# EasyEDA Pro project Source_r00fu_Synth .epro, board PCB1
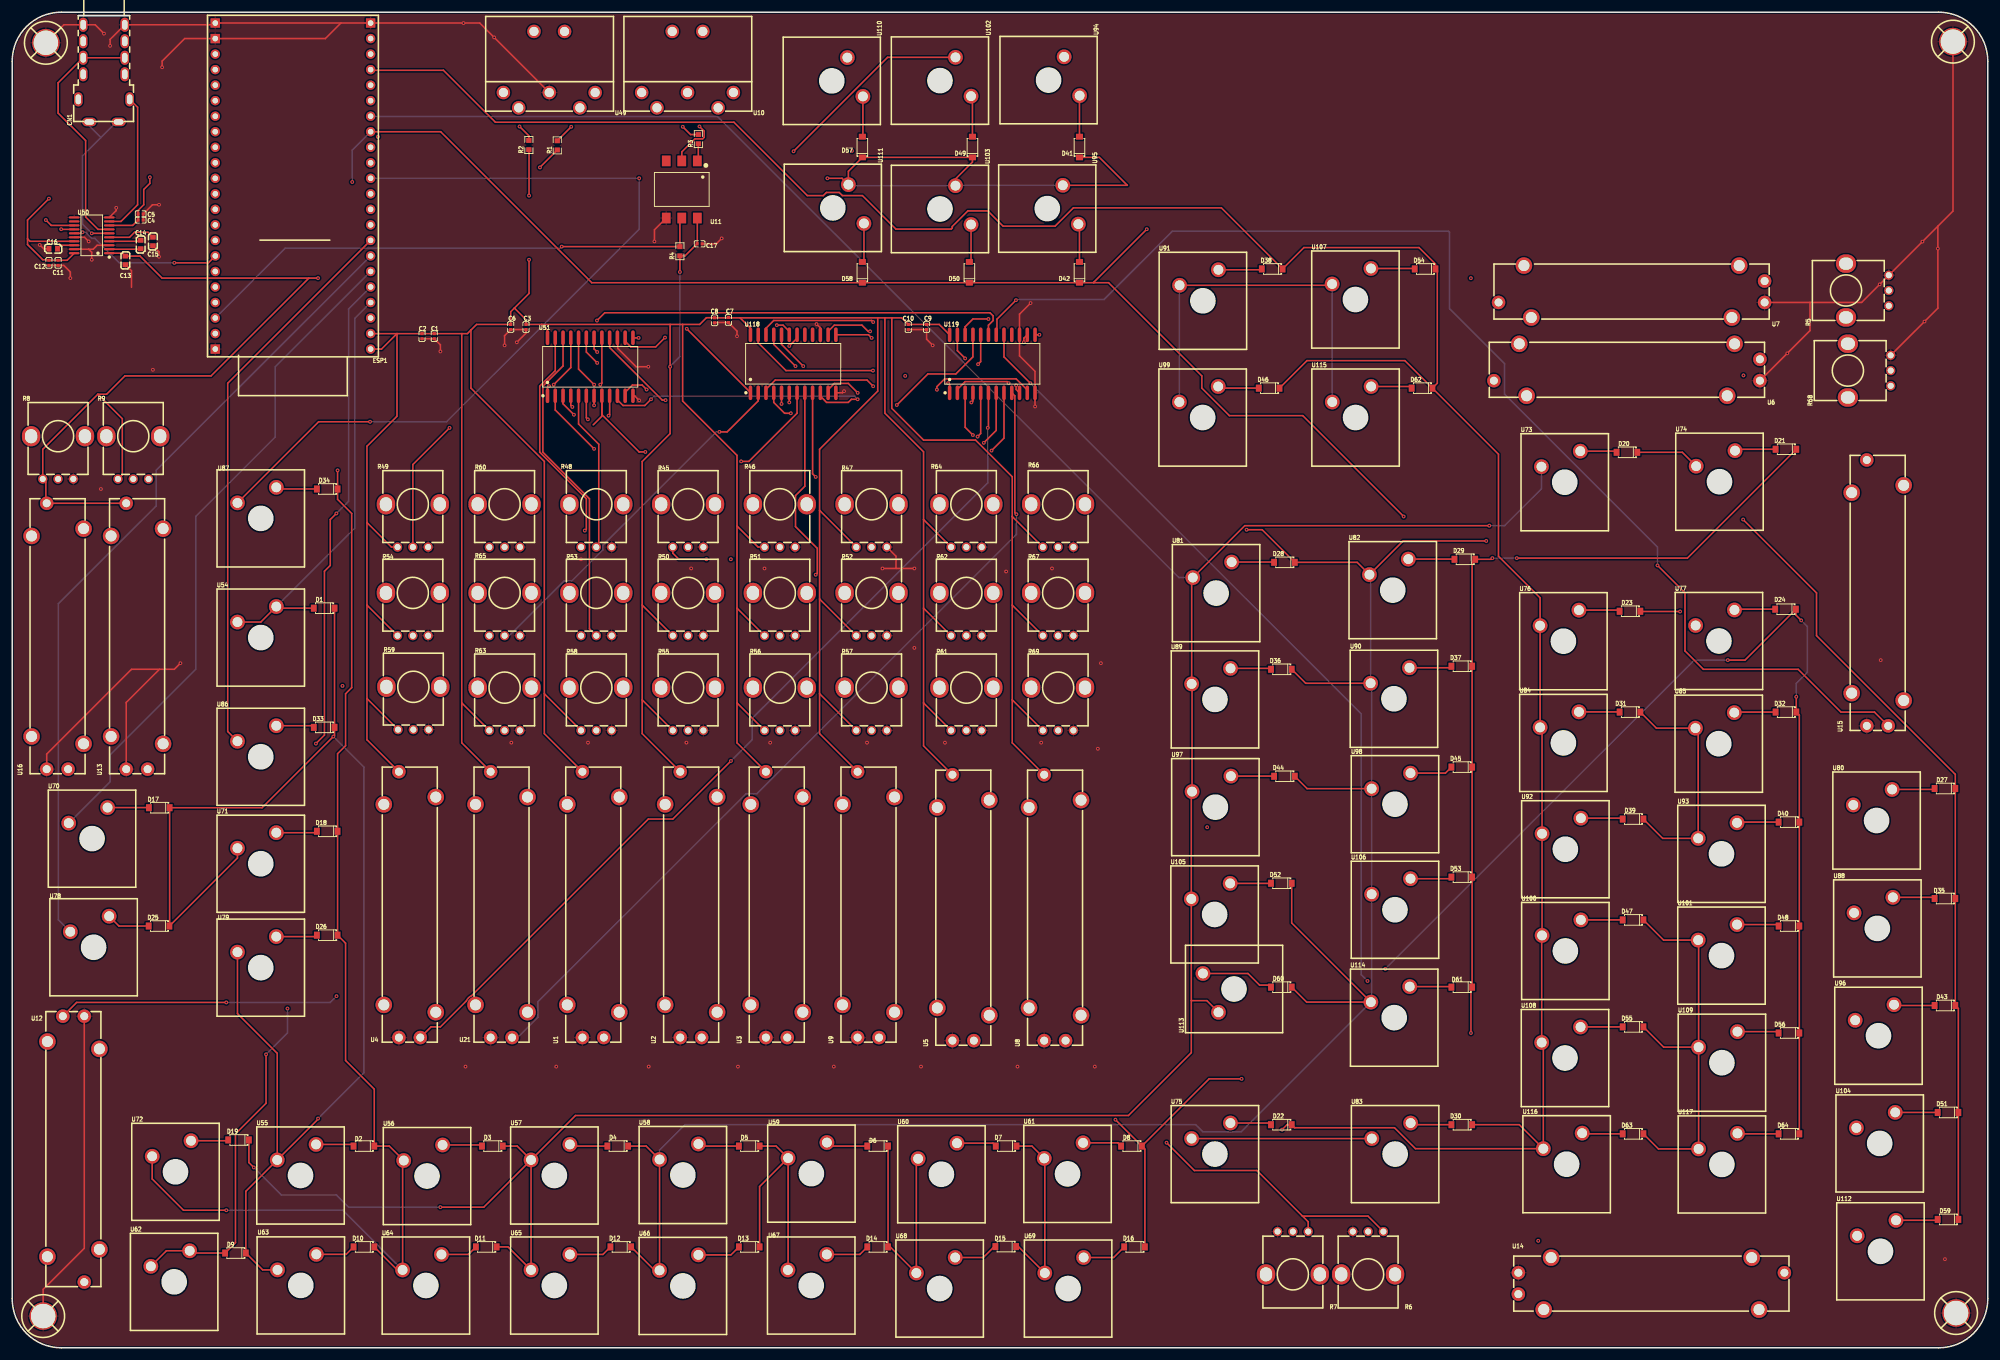
[diagram p1: board, top side]
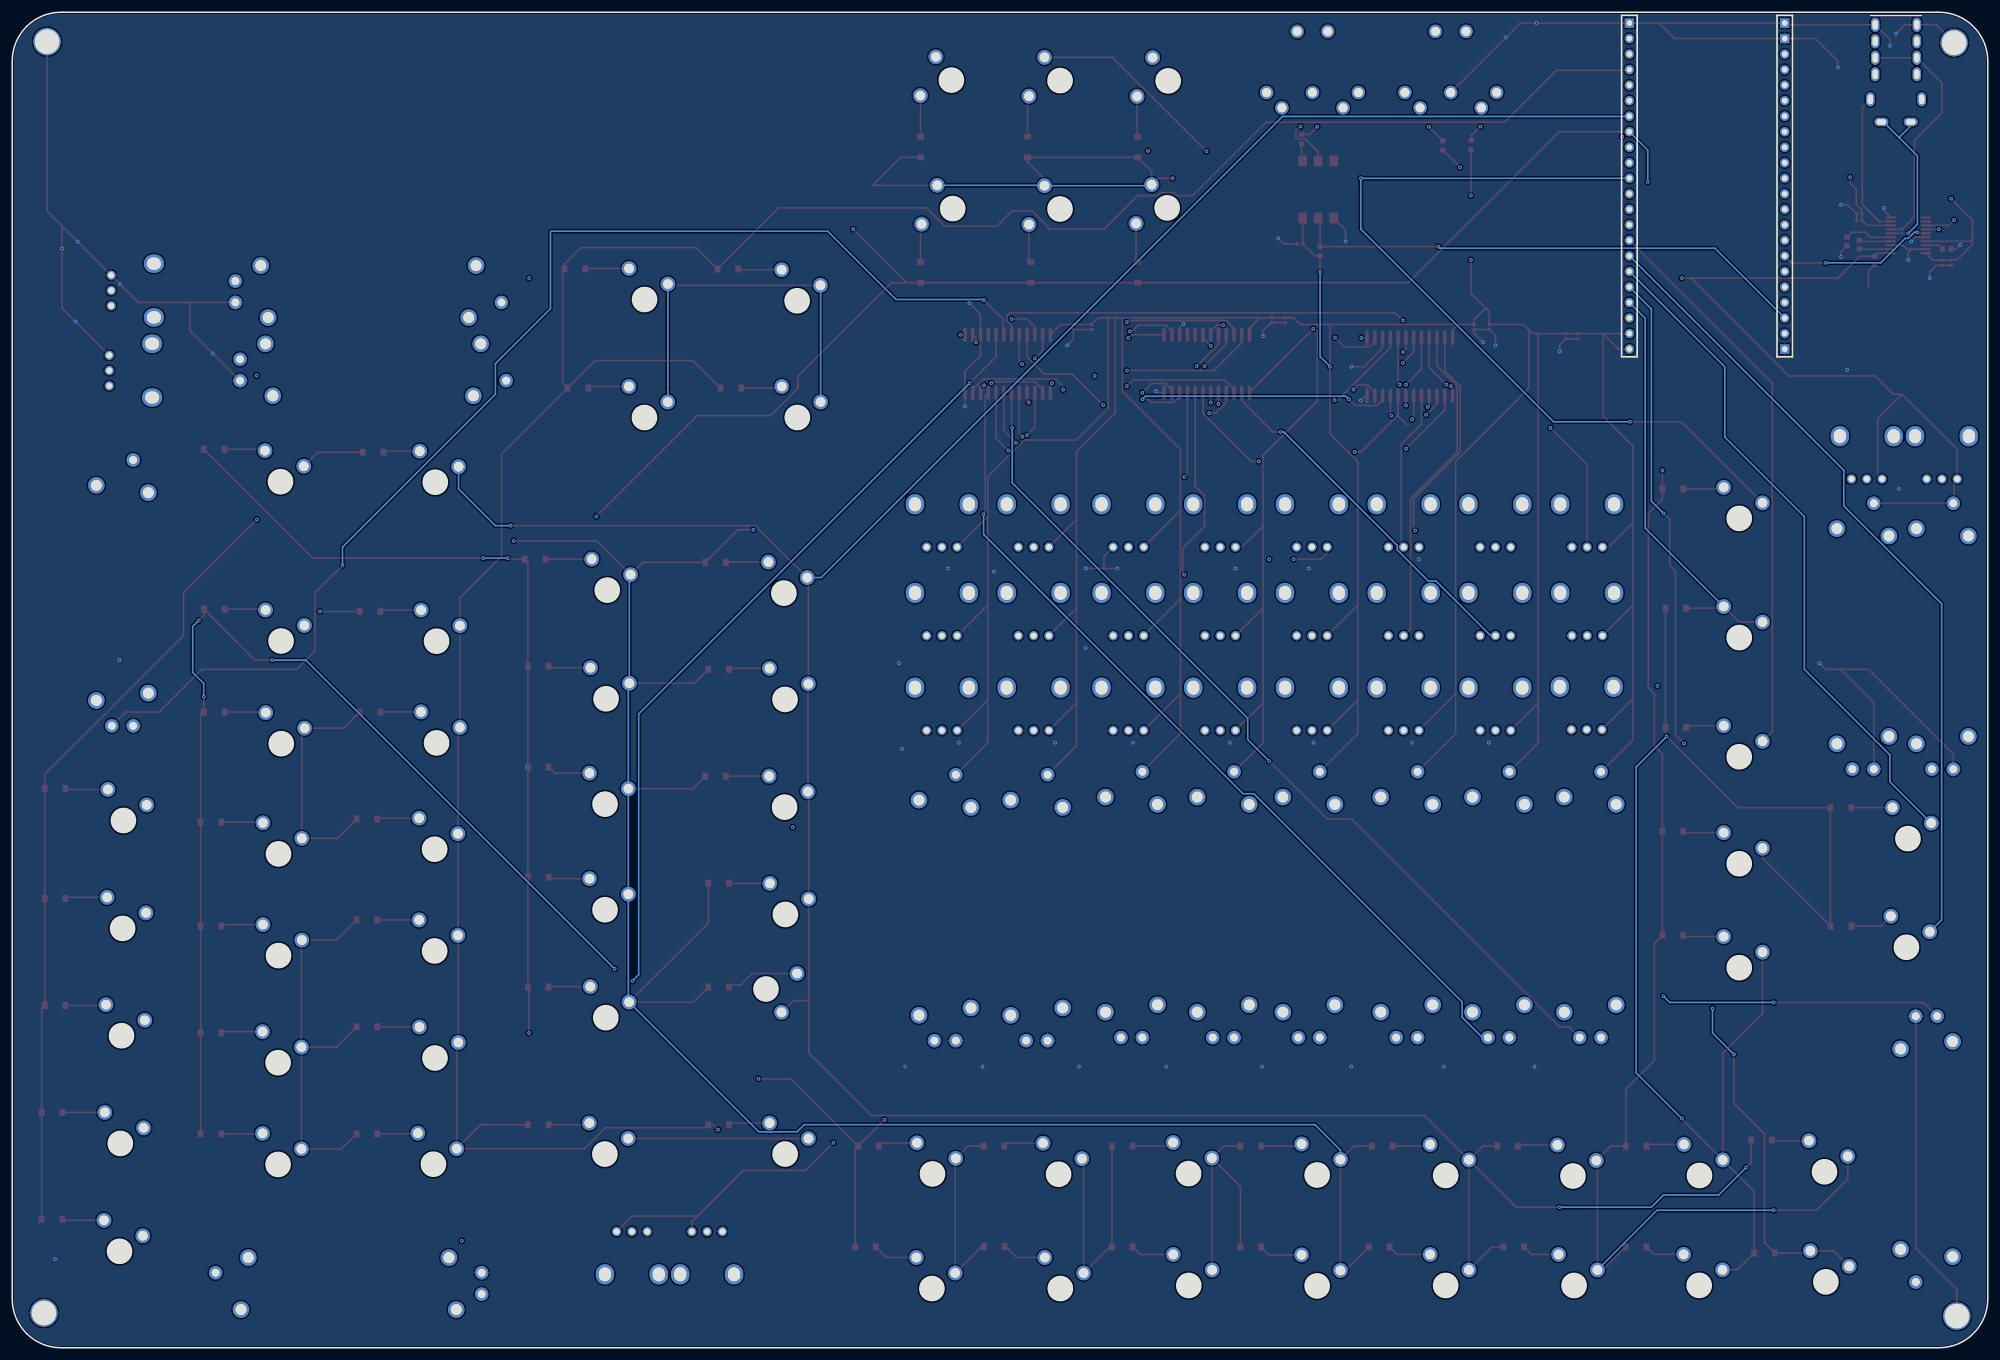
[diagram p2: board, bottom side, seen from below]

Outline 323 x 218.5 mm; copper layers: Top Layer, Inner1, Inner2, Inner3, Inner4, Inner5, Inner6, Bottom Layer. Coordinates in mm from the lower left corner of the outline.
Outline path: 0,210.5 0,8 arc(2.34,2.34) 8,0 315,0 arc(320.66,2.34) 323,8 323,210.5 arc(320.66,216.16) 315,218.5 8,218.5 arc(2.34,216.16) 0,210.5
Stack: Top Layer 0.035mm Outer layer thickness 1oz / Dielectric1 0.1164mm 2116 RC54% 4.9mil / Inner1 0.0152mm Inner layer thickness / Dielectric2 0.3mm 0.3mm H/HOZ No copper / Inner2 0.0152mm Inner layer thickness / Dielectric3 0.0764mm 1080 RC67% 3.3mil / Dielectric4 0.0764mm 1080 RC67% 3.3mil / Inner3 0.0152mm Inner layer thickness / Dielectric5 0.3mm 0.3mm H/HOZ No copper / Inner4 0.0152mm Inner layer thickness / Dielectric6 0.0764mm 1080 RC67% 3.3mil / Dielectric7 0.0764mm 1080 RC67% 3.3mil / Inner5 0.0152mm Inner layer thickness / Dielectric8 0.3mm 0.3mm H/HOZ No copper / Inner6 0.0152mm Inner layer thickness / Dielectric9 0.1164mm 2116 RC54% 4.9mil / Bottom Layer 0.035mm Outer layer thickness 1oz

## Design rules (mm)
spacing copperThickness1oz (default): track to track 0.102, other pairs 0.152 to 0.3
spacing copperThickness2oz: track to track 0.203, other pairs 0.152 to 0.3
track width copperThickness1oz (default): min 0.127, default 0.254, max 2.54
track width copperThickness2oz: min 0.203, default 0.254, max 2.54
differential pair differentialPair (default): width min 0.127, default 0.254, max 2.54; gap min 0.152, default 0.152
net GND uses copperRegion

## Placement (name value [footprint] x y rotation side)
C1  100nF  [C0402]  69 165.5 90 top
C2  10uF  [C0402]  67 165.5 90 top
C3  100nF  [C0402]  84 167 90 top
C4  100nF  [C0402]  21 184.5 180 top
C5  10uF  [C0402]  21 185.5 180 top
C6  10uF  [C0402]  81.5 167 90 top
C7  100nF  [C0402]  117.1 168.16 90 top
C8  10uF  [C0402]  114.84 168.1 90 top
C9  100nF  [C0402]  149.5 167 90 top
C10  10uF  [C0402]  146.5 167 90 top
C11  100nF  [C0402]  7.5 177.5 90 top
C12  10uF  [C0402]  6 177.5 90 top
C13  1uF  [C0603]  18.5 177.9 270 top
C14  1uF  [C0603]  21 180.5 90 top
C15  1uF  [C0603]  23 181 270 top
C16  1uF  [C0603]  6.7 179.8 0 top
C17  100nF  [C0402]  112.39 180.61 180 top
CN1  PJ-4506B-01-Z  [AUDIO-TH_PJ-4506B-01-Z]  15 208.5 90 top
D1  1N4148W  [SOD-123_L2.8-W1.8-LS3.7-RD-1]  51 121 180 top
D2  1N4148W  [SOD-123_L2.8-W1.8-LS3.7-RD-1]  57.5 33 180 top
D3  1N4148W  [SOD-123_L2.8-W1.8-LS3.7-RD-1]  78.5 33 180 top
D4  1N4148W  [SOD-123_L2.8-W1.8-LS3.7-RD-1]  99 33 180 top
D5  1N4148W  [SOD-123_L2.8-W1.8-LS3.7-RD-1]  120.5 33 180 top
D6  1N4148W  [SOD-123_L2.8-W1.8-LS3.7-RD-1]  141.5 33 180 top
D7  1N4148W  [SOD-123_L2.8-W1.8-LS3.7-RD-1]  162.5 33 180 top
D8  1N4148W  [SOD-123_L2.8-W1.8-LS3.7-RD-1]  183 33 180 top
D9  1N4148W  [SOD-123_L2.8-W1.8-LS3.7-RD-1]  36.5 15.5 180 top
D10  1N4148W  [SOD-123_L2.8-W1.8-LS3.7-RD-1]  57.5 16.5 180 top
D11  1N4148W  [SOD-123_L2.8-W1.8-LS3.7-RD-1]  77.5 16.5 180 top
D12  1N4148W  [SOD-123_L2.8-W1.8-LS3.7-RD-1]  99.5 16.5 180 top
D13  1N4148W  [SOD-123_L2.8-W1.8-LS3.7-RD-1]  120.5 16.5 180 top
D14  1N4148W  [SOD-123_L2.8-W1.8-LS3.7-RD-1]  141.5 16.5 180 top
D15  1N4148W  [SOD-123_L2.8-W1.8-LS3.7-RD-1]  162.44 16.55 180 top
D16  1N4148W  [SOD-123_L2.8-W1.8-LS3.7-RD-1]  183.5 16.5 180 top
D17  1N4148W  [SOD-123_L2.8-W1.8-LS3.7-RD-1]  24.04 88.35 180 top
D18  1N4148W  [SOD-123_L2.8-W1.8-LS3.7-RD-1]  51.5 84.5 180 top
D19  1N4148W  [SOD-123_L2.8-W1.8-LS3.7-RD-1]  37 34 180 top
D20  1N4148W  [SOD-123_L2.8-W1.8-LS3.7-RD-1]  264 146.5 180 top
D21  1N4148W  [SOD-123_L2.8-W1.8-LS3.7-RD-1]  290 147 180 top
D22  1N4148W  [SOD-123_L2.8-W1.8-LS3.7-RD-1]  207.5 36.5 180 top
D23  1N4148W  [SOD-123_L2.8-W1.8-LS3.7-RD-1]  264.5 120.5 180 top
D24  1N4148W  [SOD-123_L2.8-W1.8-LS3.7-RD-1]  289.94 120.83 180 top
D25  1N4148W  [SOD-123_L2.8-W1.8-LS3.7-RD-1]  24 69 180 top
D26  1N4148W  [SOD-123_L2.8-W1.8-LS3.7-RD-1]  51.5 67.5 180 top
D27  1N4148W  [SOD-123_L2.8-W1.8-LS3.7-RD-1]  316 91.5 180 top
D28  1N4148W  [SOD-123_L2.8-W1.8-LS3.7-RD-1]  208 128.5 180 top
D29  1N4148W  [SOD-123_L2.8-W1.8-LS3.7-RD-1]  237.5 129 180 top
D30  1N4148W  [SOD-123_L2.8-W1.8-LS3.7-RD-1]  237 36.5 180 top
D31  1N4148W  [SOD-123_L2.8-W1.8-LS3.7-RD-1]  264.5 104 180 top
D32  1N4148W  [SOD-123_L2.8-W1.8-LS3.7-RD-1]  290 104 180 top
D33  1N4148W  [SOD-123_L2.8-W1.8-LS3.7-RD-1]  51 101.5 180 top
D34  1N4148W  [SOD-123_L2.8-W1.8-LS3.7-RD-1]  51.5 140.5 180 top
D35  1N4148W  [SOD-123_L2.8-W1.8-LS3.7-RD-1]  316 73.5 180 top
D36  1N4148W  [SOD-123_L2.8-W1.8-LS3.7-RD-1]  207.5 111 180 top
D37  1N4148W  [SOD-123_L2.8-W1.8-LS3.7-RD-1]  237 111.5 180 top
D38  1N4148W  [SOD-123_L2.8-W1.8-LS3.7-RD-1]  206 176.5 180 top
D39  1N4148W  [SOD-123_L2.8-W1.8-LS3.7-RD-1]  265 86.5 180 top
D40  1N4148W  [SOD-123_L2.8-W1.8-LS3.7-RD-1]  290.5 86 180 top
D41  1N4148W  [SOD-123_L2.8-W1.8-LS3.7-RD-1]  174.49 196.44 90 top
D42  1N4148W  [SOD-123_L2.8-W1.8-LS3.7-RD-1]  174.49 175.94 90 top
D43  1N4148W  [SOD-123_L2.8-W1.8-LS3.7-RD-1]  316 56 180 top
D44  1N4148W  [SOD-123_L2.8-W1.8-LS3.7-RD-1]  208 93.5 180 top
D45  1N4148W  [SOD-123_L2.8-W1.8-LS3.7-RD-1]  237 95 180 top
D46  1N4148W  [SOD-123_L2.8-W1.8-LS3.7-RD-1]  205.5 157 180 top
D47  1N4148W  [SOD-123_L2.8-W1.8-LS3.7-RD-1]  265 70 180 top
D48  1N4148W  [SOD-123_L2.8-W1.8-LS3.7-RD-1]  290.5 69 180 top
D49  1N4148W  [SOD-123_L2.8-W1.8-LS3.7-RD-1]  156.99 196.44 90 top
D50  1N4148W  [SOD-123_L2.8-W1.8-LS3.7-RD-1]  156.49 175.94 90 top
D51  1N4148W  [SOD-123_L2.8-W1.8-LS3.7-RD-1]  316.5 38.5 180 top
D52  1N4148W  [SOD-123_L2.8-W1.8-LS3.7-RD-1]  207.5 76 180 top
D53  1N4148W  [SOD-123_L2.8-W1.8-LS3.7-RD-1]  237 77 180 top
D54  1N4148W  [SOD-123_L2.8-W1.8-LS3.7-RD-1]  231 176.5 180 top
D55  1N4148W  [SOD-123_L2.8-W1.8-LS3.7-RD-1]  265 52.5 180 top
D56  1N4148W  [SOD-123_L2.8-W1.8-LS3.7-RD-1]  290.5 51.5 180 top
D57  1N4148W  [SOD-123_L2.8-W1.8-LS3.7-RD-1]  138.99 196.44 90 top
D58  1N4148W  [SOD-123_L2.8-W1.8-LS3.7-RD-1]  138.99 175.94 90 top
D59  1N4148W  [SOD-123_L2.8-W1.8-LS3.7-RD-1]  316.5 21 180 top
D60  1N4148W  [SOD-123_L2.8-W1.8-LS3.7-RD-1]  207.5 59 180 top
D61  1N4148W  [SOD-123_L2.8-W1.8-LS3.7-RD-1]  237 59 180 top
D62  1N4148W  [SOD-123_L2.8-W1.8-LS3.7-RD-1]  230.5 157 180 top
D63  1N4148W  [SOD-123_L2.8-W1.8-LS3.7-RD-1]  265 35 180 top
D64  1N4148W  [SOD-123_L2.8-W1.8-LS3.7-RD-1]  290.5 35 180 top
ESP1  ESP32-S3-DEVKITC-MINI  [ESP32S3-DEVKIT-C1-V10]  58.6 163.39 180 top
R1  220Ω  [R0603]  89.11 196.72 90 top
R2  220Ω  [R0603]  84.47 196.77 90 top
R3  220Ω  [R0603]  112.18 197.74 90 top
R4  10kΩ  [R0603]  109.16 179.39 90 top
R5  10kΩ  [RES-ADJ-TH_RK09K1130A5R]  303.32 172.97 90 top
R6  10kΩ  [RES-ADJ-TH_RK09K1130A5R]  221.69 15.51 180 top
R7  10kΩ  [RES-ADJ-TH_RK09K1130A5R]  209.39 15.51 180 top
R8  10kΩ  [RES-ADJ-TH_RK09K1130A5R]  7.49 145.64 0 top
R9  10kΩ  [RES-ADJ-TH_RK09K1130A5R]  19.79 145.64 0 top
R45  10kΩ  [RES-ADJ-TH_RK09K1130A5R]  110.5 134.5 0 top
R46  10kΩ  [RES-ADJ-TH_RK09K1130A5R]  125.5 134.5 0 top
R47  10kΩ  [RES-ADJ-TH_RK09K1130A5R]  140.5 134.5 0 top
R48  10kΩ  [RES-ADJ-TH_RK09K1130A5R]  95.5 134.5 0 top
R49  10kΩ  [RES-ADJ-TH_RK09K1130A5R]  65.5 134.5 0 top
R50  10kΩ  [RES-ADJ-TH_RK09K1130A5R]  110.5 120 0 top
R51  10kΩ  [RES-ADJ-TH_RK09K1130A5R]  125.5 120 0 top
R52  10kΩ  [RES-ADJ-TH_RK09K1130A5R]  140.5 120 0 top
R53  10kΩ  [RES-ADJ-TH_RK09K1130A5R]  95.5 120 0 top
R54  10kΩ  [RES-ADJ-TH_RK09K1130A5R]  65.5 120 0 top
R55  10kΩ  [RES-ADJ-TH_RK09K1130A5R]  110.5 104.5 0 top
R56  10kΩ  [RES-ADJ-TH_RK09K1130A5R]  125.5 104.5 0 top
R57  10kΩ  [RES-ADJ-TH_RK09K1130A5R]  140.5 104.5 0 top
R58  10kΩ  [RES-ADJ-TH_RK09K1130A5R]  95.5 104.5 0 top
R59  10kΩ  [RES-ADJ-TH_RK09K1130A5R]  65.58 104.63 0 top
R60  10kΩ  [RES-ADJ-TH_RK09K1130A5R]  80.5 134.5 0 top
R61  10kΩ  [RES-ADJ-TH_RK09K1130A5R]  156 104.5 0 top
R62  10kΩ  [RES-ADJ-TH_RK09K1130A5R]  156 120 0 top
R63  10kΩ  [RES-ADJ-TH_RK09K1130A5R]  80.5 104.5 0 top
R64  10kΩ  [RES-ADJ-TH_RK09K1130A5R]  156 134.5 0 top
R65  10kΩ  [RES-ADJ-TH_RK09K1130A5R]  80.5 120 0 top
R66  10kΩ  [RES-ADJ-TH_RK09K1130A5R]  171 134.5 0 top
R67  10kΩ  [RES-ADJ-TH_RK09K1130A5R]  171 120 0 top
R68  10kΩ  [RES-ADJ-TH_RK09K1130A5R]  303.63 159.87 90 top
R69  10kΩ  [RES-ADJ-TH_RK09K1130A5R]  171 104.5 0 top
SCREW1  -  [Screw-Hole-M4]  5.5 213.5 0 top
SCREW2  -  [Screw-Hole-M4]  317.31 213.69 0 top
SCREW3  -  [Screw-Hole-M4]  5.06 5.19 0 top
SCREW4  -  [Screw-Hole-M4]  317.81 5.69 0 top
U1  PTA3043-2010CIB103  [RES-ADJ-TH_PTA3043]  95 72.5 90 top
U2  PTA3043-2010CIB103  [RES-ADJ-TH_PTA3043]  111 72.5 90 top
U3  PTA3043-2010CIB103  [RES-ADJ-TH_PTA3043]  125 72.5 90 top
U4  PTA3043-2010CIB103  [RES-ADJ-TH_PTA3043]  65 72.5 90 top
U5  PTA3043-2010CIB103  [RES-ADJ-TH_PTA3043]  155.5 72 90 top
U6  PTA3043-2010CIB103  [RES-ADJ-TH_PTA3043]  264 160 180 top
U7  PTA3043-2010CIB103  [RES-ADJ-TH_PTA3043]  264.76 172.8 180 top
U8  PTA3043-2010CIB103  [RES-ADJ-TH_PTA3043]  170.5 72 90 top
U9  PTA3043-2010CIB103  [RES-ADJ-TH_PTA3043]  140 72.5 90 top
U10  DIN-504D-M5  [CONN-TH_DIN-504D-M5]  110.41 209.11 180 top
U11  H11L1SR2M  [SMD-6_L8.7-W6.5-P2.54-LS10.6-BL]  109.47 189.5 180 top
U12  PTA3043-2010CIB103  [RES-ADJ-TH_PTA3043]  10 32.5 270 top
U13  PTA3043-2010CIB103  [RES-ADJ-TH_PTA3043]  20.41 116.41 90 top
U14  PTA3043-2010CIB103  [RES-ADJ-TH_PTA3043]  268 10.5 0 top
U15  PTA3043-2010CIB103  [RES-ADJ-TH_PTA3043]  305 123.5 90 top
U16  PTA3043-2010CIB103  [RES-ADJ-TH_PTA3043]  7.41 116.41 90 top
U21  PTA3043-2010CIB103  [RES-ADJ-TH_PTA3043]  80 72.5 90 top
U49  DIN-504D-M5  [CONN-TH_DIN-504D-M5]  87.81 209.11 180 top
U50  PCM5102APW  [TSSOP-20_L6.5-W4.4-P0.65-LS6.4-BL]  13 182 90 top
U51  CD74HC4067M  [SOIC-24_L15.4-W7.5-P1.27-LS10.3-BL]  94.5 160.5 0 top
U54  CPG151101D01  [SW-TH_CPG151101D9X]  40 120 0 top
U55  CPG151101D01  [SW-TH_CPG151101D9X]  46.5 32 0 top
U56  CPG151101D01  [SW-TH_CPG151101D9X]  67.19 31.91 0 top
U57  CPG151101D01  [SW-TH_CPG151101D9X]  88 32 0 top
U58  CPG151101D01  [SW-TH_CPG151101D9X]  109.01 32.07 0 top
U59  CPG151101D01  [SW-TH_CPG151101D9X]  130.03 32.31 0 top
U60  CPG151101D01  [SW-TH_CPG151101D9X]  151.29 32.2 0 top
U61  CPG151101D01  [SW-TH_CPG151101D9X]  171.91 32.26 0 top
U62  CPG151101D01  [SW-TH_CPG151101D9X]  25.84 14.6 0 top
U63  CPG151101D01  [SW-TH_CPG151101D9X]  46.55 14.02 0 top
U64  CPG151101D01  [SW-TH_CPG151101D9X]  67 14 0 top
U65  CPG151101D01  [SW-TH_CPG151101D9X]  88 14 0 top
U66  CPG151101D01  [SW-TH_CPG151101D9X]  109.01 13.93 0 top
U67  CPG151101D01  [SW-TH_CPG151101D9X]  130 14 0 top
U68  CPG151101D01  [SW-TH_CPG151101D9X]  151 13.5 0 top
U69  CPG151101D01  [SW-TH_CPG151101D9X]  172 13.5 0 top
U70  CPG151101D01  [SW-TH_CPG151101D9X]  12.41 87.11 0 top
U71  CPG151101D01  [SW-TH_CPG151101D9X]  40 83 0 top
U72  CPG151101D01  [SW-TH_CPG151101D9X]  26.06 32.6 0 top
U73  CPG151101D01  [SW-TH_CPG151101D9X]  253.2 145.42 0 top
U74  CPG151101D01  [SW-TH_CPG151101D9X]  278.5 145.5 0 top
U75  CPG151101D01  [SW-TH_CPG151101D9X]  196 35.5 0 top
U76  CPG151101D01  [SW-TH_CPG151101D9X]  252.98 119.41 0 top
U77  CPG151101D01  [SW-TH_CPG151101D9X]  278.41 119.44 0 top
U78  CPG151101D01  [SW-TH_CPG151101D9X]  12.67 69.34 0 top
U79  CPG151101D01  [SW-TH_CPG151101D9X]  40 66 0 top
U80  CPG151101D01  [SW-TH_CPG151101D9X]  304.19 90.08 0 top
U81  CPG151101D01  [SW-TH_CPG151101D9X]  196.2 127.28 0 top
U82  CPG151101D01  [SW-TH_CPG151101D9X]  225.08 127.76 0 top
U83  CPG151101D01  [SW-TH_CPG151101D9X]  225.47 35.5 0 top
U84  CPG151101D01  [SW-TH_CPG151101D9X]  252.98 102.77 0 top
U85  CPG151101D01  [SW-TH_CPG151101D9X]  278.38 102.64 0 top
U86  CPG151101D01  [SW-TH_CPG151101D9X]  40 100.5 0 top
U87  CPG151101D01  [SW-TH_CPG151101D9X]  40 139.5 0 top
U88  CPG151101D01  [SW-TH_CPG151101D9X]  304.31 72.42 0 top
U89  CPG151101D01  [SW-TH_CPG151101D9X]  196.01 109.88 0 top
U90  CPG151101D01  [SW-TH_CPG151101D9X]  225.28 109.99 0 top
U91  CPG151101D01  [SW-TH_CPG151101D9X]  194.04 175.1 0 top
U92  CPG151101D01  [SW-TH_CPG151101D9X]  253.3 85.38 0 top
U93  CPG151101D01  [SW-TH_CPG151101D9X]  278.83 84.61 0 top
U94  CPG151101D01  [SW-TH_CPG151101D9X]  173.25 208.03 270 top
U95  CPG151101D01  [SW-TH_CPG151101D9X]  173.04 187.01 270 top
U96  CPG151101D01  [SW-TH_CPG151101D9X]  304.5 54.86 0 top
U97  CPG151101D01  [SW-TH_CPG151101D9X]  196.08 92.26 0 top
U98  CPG151101D01  [SW-TH_CPG151101D9X]  225.44 92.75 0 top
U99  CPG151101D01  [SW-TH_CPG151101D9X]  194 156 0 top
U100  CPG151101D01  [SW-TH_CPG151101D9X]  253.3 68.73 0 top
U101  CPG151101D01  [SW-TH_CPG151101D9X]  278.83 67.97 0 top
U102  CPG151101D01  [SW-TH_CPG151101D9X]  155.49 207.94 270 top
U103  CPG151101D01  [SW-TH_CPG151101D9X]  155.49 186.94 270 top
U104  CPG151101D01  [SW-TH_CPG151101D9X]  304.69 37.24 0 top
U105  CPG151101D01  [SW-TH_CPG151101D9X]  195.95 74.71 0 top
U106  CPG151101D01  [SW-TH_CPG151101D9X]  225.44 75.47 0 top
U107  CPG151101D01  [SW-TH_CPG151101D9X]  218.98 175.31 0 top
U108  CPG151101D01  [SW-TH_CPG151101D9X]  253.24 51.21 0 top
U109  CPG151101D01  [SW-TH_CPG151101D9X]  278.9 50.45 0 top
U110  CPG151101D01  [SW-TH_CPG151101D9X]  137.81 207.9 270 top
U111  CPG151101D01  [SW-TH_CPG151101D9X]  137.98 187.12 270 top
U112  CPG151101D01  [SW-TH_CPG151101D9X]  304.82 19.59 0 top
U113  CPG151101D01  [SW-TH_CPG151101D9X]  195.95 58.06 90 top
U114  CPG151101D01  [SW-TH_CPG151101D9X]  225.31 57.82 0 top
U115  CPG151101D01  [SW-TH_CPG151101D9X]  219 156 0 top
U116  CPG151101D01  [SW-TH_CPG151101D9X]  253.51 33.84 0 top
U117  CPG151101D01  [SW-TH_CPG151101D9X]  278.9 33.81 0 top
U118  CD74HC4067M  [SOIC-24_L15.4-W7.5-P1.27-LS10.3-BL]  127.68 160.99 0 top
U119  CD74HC4067M  [SOIC-24_L15.4-W7.5-P1.27-LS10.3-BL]  160.25 160.98 0 top

## Footprints (pads in the part's own frame, mm; a bottom-side part is the same pattern mirrored in y, then rotated)
AUDIO-TH_PJ-4506B-01-Z
  oval 2.3x1.4 hole 1.6x0.9: A(7.95,-3.4) B(5.25,-3.4) C(2.55,-3.4) D(-0.15,-3.4) E(7.95,3.4) F(5.25,3.4) G(2.55,3.4) H(-0.15,3.4) K(-4.25,-4.2) L(-4.25,4.2)
  oval 1.4x2.3 hole 0.9x1.6: I(-7.95,-2.4) J(-7.95,2.4)
C0402
  rect 0.5x0.54 smd: 1(-0.42,0) 2(0.42,0)
C0603
  rect 0.8x0.9 smd: 1(-0.7,0) 2(0.7,0)
CONN-TH_DIN-504D-M5
  round 2.2 hole 1.5: 1(7.5,3.75) 2(0,3.75) 3(-7.5,3.75) 4(5,6.25) 5(-5,6.25) 6(-2.5,-6.25) 7(2.5,-6.25)
ESP32S3-DEVKIT-C1-V10
  round 1.524 hole 0.914: 0(25.4,-33.02) 1(25.4,-7.62) 2(25.4,-10.16) 3(0,-30.48) 4(0,-7.62) 5(0,-10.16) 5V(0,-50.8) 6(0,-12.7) 7(0,-15.24) 8(0,-27.94) 9(0,-35.56) 10(0,-38.1) 11(0,-40.64) 12(0,-43.18) 13(0,-45.72) 14(0,-48.26) 15(0,-17.78) 16(0,-20.32) 17(0,-22.86) 18(0,-25.4) 19(25.4,-48.26) 20(25.4,-45.72) 21(25.4,-43.18) 35(25.4,-30.48) 36(25.4,-27.94) 37(25.4,-25.4) 38(25.4,-22.86) 39(25.4,-20.32) 40(25.4,-17.78) 41(25.4,-15.24) 42(25.4,-12.7) 45(25.4,-35.56) 46(0,-33.02) 47(25.4,-40.64) 48(25.4,-38.1) RST(0,-5.08) RX(25.4,-5.08) TX(25.4,-2.54) VDD_1(0,0) VDD_2(0,-2.54)
  rect 1.524x1.524 hole 0.914: G1(0,-53.34) G2(25.4,0) G3(25.4,-50.8) G4(25.4,-53.34)
R0603
  rect 0.806x0.864 smd: 1(-0.753,0) 2(0.753,0)
RES-ADJ-TH_PTA3043
  round 2.2 hole 1.3: 1(-21.75,1.778) 2(-21.75,-1.722) 3(21.75,1.778)
  round 2.7 hole 1.8: 4(16.4,4.25) 5(-16.4,4.25) 6(-17.6,-4.25) 7(17.6,-4.25)
RES-ADJ-TH_RK09K1130A5R
  round 1.5 hole 1: 1(-2.5,-3.5) 2(0,-3.5) 3(2.5,-3.5)
  oval 3x3.3 hole 2x2.3: 4(4.4,3.5) 5(-4.4,3.5)
Screw-Hole-M4
  round 4.5 hole 4: 1(0,0)
SMD-6_L8.7-W6.5-P2.54-LS10.6-BL
  rect 1.423x1.75 smd: 1(-2.54,-4.675) 2(0,-4.675) 3(2.54,-4.675) 4(2.54,4.675) 5(0,4.675) 6(-2.54,4.675)
SOD-123_L2.8-W1.8-LS3.7-RD-1
  rect 0.95x1.15 smd: 1(-1.692,0) 2(1.692,0)
SOIC-24_L15.4-W7.5-P1.27-LS10.3-BL
  oval 0.574x2.388 smd: 1(-6.985,-4.744) 2(-5.715,-4.744) 3(-4.445,-4.744) 4(-3.175,-4.744) 5(-1.905,-4.744) 6(-0.635,-4.744) 7(0.635,-4.744) 8(1.905,-4.744) 9(3.175,-4.744) 10(4.445,-4.744) 11(5.715,-4.744) 12(6.985,-4.744) 13(6.985,4.744) 14(5.715,4.744) 15(4.445,4.744) 16(3.175,4.744) 17(1.905,4.744) 18(0.635,4.744) 19(-0.635,4.744) 20(-1.905,4.744) 21(-3.175,4.744) 22(-4.445,4.744) 23(-5.715,4.744) 24(-6.985,4.744)
SW-TH_CPG151101D9X
  round 2.4 hole 1.6: 1(-3.175,-1.27) 2(3.175,1.27)
TSSOP-20_L6.5-W4.4-P0.65-LS6.4-BL
  oval 0.364x1.742 smd: 1(-2.925,-2.871) 2(-2.275,-2.871) 3(-1.625,-2.871) 4(-0.975,-2.871) 5(-0.325,-2.871) 6(0.325,-2.871) 7(0.975,-2.871) 8(1.625,-2.871) 9(2.275,-2.871) 10(2.925,-2.871) 11(2.925,2.871) 12(2.275,2.871) 13(1.625,2.871) 14(0.975,2.871) 15(0.325,2.871) 16(-0.325,2.871) 17(-0.975,2.871) 18(-1.625,2.871) 19(-2.275,2.871) 20(-2.925,2.871)

## Nets
As in the schematic.

Pads without a net: CN1 B D F H L; ESP1 0 19 20 39 45 46 47 48 RST; R5 4 5; R6 4 5; R7 4 5; R8 4 5; R9 3 4 5; R45 4 5; R46 4 5; R47 4 5; R48 4 5; R49 4 5; R50 4 5; R51 4 5; R52 4 5; R53 4 5; R54 4 5; R55 4 5; R56 4 5; R57 4 5; R58 4 5; R59 4 5; R60 4 5; R61 4 5; R62 4 5; R63 4 5; R64 4 5; R65 4 5; R66 4 5; R67 4 5; R68 4 5; R69 4 5; U1 4 5 6 7; U2 4 5 6 7; U3 4 5 6 7; U4 4 5 6 7; U5 4 5 6 7; U6 4 5 6 7; U7 4 5 6 7; U8 4 5 6 7; U9 4 5 6 7; U10 1 2 3 6 7; U11 3; U12 4 5 6 7; U13 4 5 6 7; U14 4 5 6 7; U15 4 5 6 7; U16 4 5 6 7; U21 4 5 6 7; U49 1 3 6 7; U50 12

## Via types
v1: diameter 0.61, hole 0.305, Top Layer to Bottom Layer, 185 vias

## Routing (per net, layer and track width the routed paths; a pad name or vN(x,y) marks a point on that pad's centre or on a via; arc(x,y) is an arc through that point)
+3.3V: length 1795.1
  Top Layer w0.254: 143.81,168.5 145.42,168.5 C10.2 C9.2 151.56,167.42 U119.24 ; 143.81,168.5 142.68,168.5 ; 143.81,168.5 143.81,153.69 149,148.5 157.5,148.5 163.5,142.5 163.5,136 ; 73.53,165.92 C1.2 C2.2 62.91,165.92 ; 73.53,165.92 73.5,165.9 73.5,105.5 ; 73.53,165.92 74.42,165.92 75,166.5 ; 210.96,21.54 203.5,29 193.28,29 v1(188.73,33.55) ; 210.96,21.54 221.66,21.54 R6.1 ; 210.96,21.54 211.89,20.61 R7.1 ; 2.5,181.42 2.5,184.5 v1(6,188) ; 2.5,181.42 2.5,180.5 5,178 5.92,178 C12.2 C11.2 8.97,177.92 U50.20 ; 2.5,181.42 2.89,181.03 U50.17 ; 58,135 58,147.5 62.91,152.41 62.91,165.92 ; 58,135 58,121.5 ; 58,135 62,131 R49.1 ; R52.1 132,122.5 ; 132,122.5 132,137 ; 132,122.5 132,107 ; 48.5,175 24.5,175 20.9,178.6 C13.1 18.02,179.07 15.87,179.07 ; 48.5,175 32.5,159 18.42,159 15.42,156 14,156 ; 48.5,175 v1(50,175) ; R59.1 58,106.21 ; 58,106.21 58,99.47 U4.3 ; 58,106.21 58,121.5 ; R57.1 132,107 ; 132,107 132,100.47 U9.3 ; 163.5,136 163.5,121.5 ; 163.5,136 R66.1 ; U11.6 112.01,180.65 C17.2 110,178.64 R4.1 v1(109.16,176) ; U5.3 149,98.47 149,105.5 ; 119,168.5 114.86,168.5 C8.2 113.5,168.52 112.4,167.42 109.61,167.42 ; 119,168.5 141.51,168.5 ; 119,168.5 120.7,166.8 U118.24 ; 87,107 87,100.47 U1.3 ; 87,107 87,145 75,157 75,166.5 ; 87,107 R58.1 ; 149,121 149,135.5 ; 149,121 149,105.5 ; 149,121 R62.1 ; 149,135.5 R64.1 ; 149,135.5 149,146.58 142.68,152.9 142.68,168.5 ; v1(84.5,178) 84.5,172.5 82.1,170.1 ; U13.3 U16.3 5.5,138.3 5.5,141.62 R8.1 4.99,146.99 14,156 ; 149,105.5 R61.1 ; 82.1,170.1 84,168.21 C3.2 86.58,167.42 ; 82.1,170.1 81.5,169.5 C6.2 75.92,167.42 75,166.5 ; U50.8 19.7,183.62 C4.2 C5.2 20.58,186.08 21.5,187 21.5,189.5 22.5,190.5 v1(22.5,191.5) ; R46.1 121.94,131 118.5,134.45 ; R69.1 163.5,106 ; 163.5,106 163.5,98.97 U8.3 ; 163.5,106 163.5,121.5 ; 14,156 18,152 18,142.85 R9.1 ; R47.1 132,137 ; 132,137 132,147 141.51,156.51 141.51,168.5 ; R54.1 58,121.5 ; 62.91,165.92 60.38,163.39 ESP1.VDD_1 ; 62.91,165.92 58.61,165.92 ESP1.VDD_2 ; 142.68,168.5 141.51,168.5 ; v1(113.5,129) 109,129 108,130 R45.1 ; v1(84.5,188.5) 84.5,195.98 R2.1 ; 118.5,134.45 118.5,121 ; 118.5,134.45 118.5,146 109.61,154.89 109.61,167.42 ; 163.5,121.5 R67.1 ; 109.61,167.42 107.56,167.42 ; 118.5,121 118.5,105.5 ; 118.5,121 R51.1 ; 86.58,167.42 107.56,167.42 ; 86.58,167.42 87.5,166.5 87.5,165.26 U51.24 ; 73.5,105.5 73.5,98.97 U21.3 ; 73.5,105.5 R63.1 ; 107.56,167.42 v1(107.56,160.5) 107.56,149.56 103,145 103,121.5 ; 103,121.5 103,106 ; 103,121.5 R50.1 ; 103,106 103,100.47 U2.3 ; 103,106 R55.1 ; 118.5,105.5 118.5,98.97 U3.3 ; 118.5,105.5 R56.1
  Inner3 w0.254: 309,159.24 309,151.03 U15.3 ; 309,159.24 R68.1 ; 309,159.24 309,172.65 ; v1(117.5,129) v1(113.5,129) ; v1(249.5,17.5) 247.99,19.01 R6.1 ; v1(238.49,174.99) 245.5,182 303.5,182 309,176.5 309,172.65 ; 309,172.65 R5.1
  Inner4 w0.254: U14.3 260.22,12.28 255,17.5 v1(249.5,17.5) ; ESP1.VDD_2 50,174.53 v1(50,175) ; U8.3 171,91.47 171,88.5 179.5,80 179.5,42.78 v1(188.73,33.55)
  Inner5 w0.254: R45.1 105,128 90,128 ; 90,128 80,128 78,130 R60.1 ; 90,128 R48.1 ; v1(6,188) 19,188 v1(22.5,191.5) 23,192 23,194 32,203 32.25,203 32.72,202.53 33.63,202.53 34.24,201.92 34.24,201.02 50,185.25 v1(50,175) ; 235,167.24 235,171.5 v1(238.49,174.99) ; 235,167.24 238.78,171.02 U7.3 ; 235,167.24 235,165.47 U6.3 213.53,129.5 200.5,129.5 arc(199.37,130.03) 198.24,129.5 170,129.5 R66.1 ; v1(117.5,129) 121,129 R46.1
  Inner6 w0.254: R65.1 79.5,115 ; 79.5,115 91.5,115 R53.1 ; 79.5,115 64.5,115 R54.1 ; U12.3 20.03,19 25,19 35,29 35,48 63.22,76.22 U4.3 ; v1(84.5,188.5) v1(84.5,178)
  Bottom Layer w0.254: 107.5,160.5 109.16,162.16 v1(109.16,176)
AGND: length 23.5
  Top Layer w0.254: U50.9 17.77,184.28 20.5,187 20.5,202.95 CN1.K
GND: length 1013.8
  Top Layer w0.254: 314.84,183.49 v1(314.84,179.83) 314.84,170.09 v1(312.65,167.89) R68.3 ; 314.84,183.49 v1(312.32,180.97) R5.3 v1(305.33,173.98) 302.37,171.02 293.94,171.02 ; 314.84,183.49 317.31,185.95 SCREW2.1 ; U118.12 135.74,156.24 v1(136,156.5) ; v1(27.5,112) 26.5,111 24.06,111 ; v1(16,213) 16,214.05 CN1.A 32.92,216.45 ESP1.G4 53.73,216.73 ; U12.1 11.78,16.28 5.06,9.56 SCREW3.1 ; 24.06,111 18.64,105.57 U13.1 ; 24.06,111 19.5,111 5.64,97.14 U16.1 ; v1(167.23,154) U119.12 167.23,159.74 164.69,162.28 U119.15 164.69,169.11 v1(166.5,170.92) ; v1(102.5,155) 101.74,155.76 U51.12 ; 53.73,216.73 ESP1.G1 v1(73.78,216.73) 76.44,216.73 v1(78.79,214.38) U49.2 ; 53.73,216.73 51.19,214.19 ESP1.G3 28.19,214.19 24.5,210.5 v1(24.5,209.5) ; 144.5,127.5 v1(147.5,127.5) ; 144.5,127.5 144.5,129.5 R47.3 ; 144.5,127.5 v1(142.28,127.5) ; SCREW1.1 8.45,216.45 CN1.E 13.55,216.45 v1(15,215) ; 5.51,177.09 5.5,177.08 ; U50.10 17,186.05 v1(17,186.5) ; v1(24,178.5) 24,179.3 C15.2 ; C2.1 C1.1 70,164.08 v1(70,163) ; U6.1 v1(290.22,162.69) 293.94,166.42 293.94,171.02 ; U118.15 132.13,166.86 v1(131.5,167.48) ; v1(4.5,180.44) 5.14,179.8 C16.1 ; C13.2 19.5,176.2 19.5,173.5 ; v1(82.5,164.5) 84,166 C3.1 C6.1 80.5,165.58 v1(80.5,164) ; C4.1 C5.1 22.92,187 v1(24,187) ; v1(9.5,175) 9.5,176 8.42,177.08 C11.1 C12.1 ; U50.16 11.82,181.68 v1(12.5,181) ; 12.5,179.72 13,179.22 v1(13,178) ; 12.5,179.72 U50.19 ; 12.5,179.72 13.22,179.72 13.88,180.38 U50.3 ; v1(116,181.5) 115.11,180.61 112.81,180.61 ; 293.94,171.02 286.51,171.02 ; v1(118.5,165.5) 118.5,166.33 C7.1 114.9,167.74 C8.1 ; U11.4 105,182.9 v1(105,181) ; v1(150.5,164) 149.5,165 C9.1 C10.1 ; U51.15 99,165.19 99,163.5 102,160.5 v1(104,160.5)
  Inner1 w0.254: v1(170,127.5) R66.3 ; R64.3 v1(162.5,127)
  Inner2 w0.254: 114.26,114.5 114.26,115.24 R50.3 ; 114.26,114.5 99.81,114.5 ; 114.26,114.5 129.52,114.5 ; 99.81,114.5 84.96,114.5 ; 99.81,114.5 99.81,114.69 R53.3 ; 85.5,129 70,129 R49.3 ; 85.5,129 83.5,131 R60.3 ; 85.5,129 v1(93,129) ; 129.52,114.5 144,114.5 ; 129.52,114.5 128,116.02 R51.3 ; 144,114.5 v1(147.5,114.5) ; 144,114.5 144,115.5 R52.3 ; 84.96,114.5 70,114.5 R54.3 ; 84.96,114.5 84.96,114.54 R65.3
  Inner3 w0.254: v1(147.5,127.5) 155,127.5 ; 155,127.5 v1(170,127.5) ; 155,127.5 R64.3
  Inner4 w0.254: R56.3 128.93,100.07 128.93,99 ; 145,99 R57.3 ; 145,99 v1(139.76,99) 128.93,99 ; 145,99 v1(152.5,99) ; 100,129 R48.3 ; 100,129 v1(93,129) ; 100,129 112,129 113.5,127.5 v1(123,127.5) ; U4.1 67.97,46 v1(74.11,46) 81.5,46 ; 142.97,46 v1(134.33,46) 127.31,46 ; 142.97,46 U9.1 ; 142.97,46 v1(148.58,46) 157.97,46 ; 171.01,46 168.72,48.29 U8.1 ; 171.01,46 v1(177,46) ; 171.01,46 v1(164.36,46) 157.97,46 ; 84.01,99 83,100.01 R63.3 ; 84.01,99 v1(94.14,99) 99,99 ; 84.01,99 v1(81.6,99) 70.21,99 R59.3 ; 113.5,99 v1(123.93,99) 128.93,99 ; 113.5,99 113,99.5 R55.3 ; 113.5,99 v1(110.23,99) 99,99 ; v1(316,14.5) 317.81,12.69 SCREW4.1 ; 81.5,46 v1(88.94,46) 96,46 ; 81.5,46 78.22,49.28 U21.1 ; 96,46 v1(104.07,46) 111.57,46 ; 96,46 93.22,48.78 U1.1 ; 157.97,46 U5.1 ; U3.1 123.22,50.09 127.31,46 ; 111.57,46 v1(118.65,46) 127.31,46 ; 111.57,46 109.22,48.35 U2.1 ; U15.1 303.22,110.22 v1(305.5,112.5) ; 99,99 98,100 R58.3
  Inner5 w0.254: v1(111,127.5) 112,128.5 112.5,128.5 112.92,128.92 112.92,129.24 113,129.33 R45.3 ; R46.3 129,130 129,127.5 ; 129,127.5 v1(142.28,127.5) ; 129,127.5 v1(123,127.5)
  Inner6 w0.254: 159.83,114.5 174.37,114.5 ; 159.83,114.5 159.83,115.17 R62.3 ; 159.83,114.5 v1(147.5,114.5) ; 174.37,114.5 174.37,115.63 R67.3 ; 174.37,114.5 175.5,114.5 v1(178,112) ; v1(23,160) 29.81,160 ESP1.G2 ; 174.65,99 v1(168.23,99) 159.5,99 ; 174.65,99 176.5,99 v1(177.5,98) ; 174.65,99 174.65,99.85 R69.3 ; v1(14.5,140.5) 11.62,140.5 R8.3 ; v1(152.5,99) 159.5,99 ; 159.5,99 159.5,100 R61.3
1S0: length 164
  Top Layer w0.254: v1(104.44,155.18) 103.43,154.16 99.87,154.16 98.94,155.08 U51.10 ; v1(138.22,155.18) 137.21,155.18 136.7,154.67 133.14,154.67 132.13,155.68 U118.10 ; U119.10 164.13,156.79 v1(164.13,157.46)
  Inner4 w0.254: ESP1.35 34.3,192.77 66.85,192.77 v1(104.44,155.18) ; v1(138.22,155.18) 138.99,155.94 162.61,155.94 v1(164.13,157.46)
  Bottom Layer w0.254: v1(138.22,155.18) 137.72,155.68 104.95,155.68 v1(104.44,155.18)
1S1: length 166.3
  Top Layer w0.254: U51.11 100.22,156.32 101.4,157.5 102.99,157.5 v1(103.72,156.77) ; U118.11 133.4,156.75 134.41,157.77 136.7,157.77 v1(138.23,156.23) ; U119.11 165.92,156.28 165.92,156.74 164.14,158.52 152.46,158.52 151.19,157.25 v1(151.19,156.74)
  Inner2 w0.254: v1(103.72,156.77) 104.73,155.76 137.75,155.76 v1(138.23,156.23)
  Inner3 w0.254: v1(138.23,156.23) 150.68,156.23 v1(151.19,156.74) ; v1(103.72,156.77) 83.14,177.35 58.25,177.35 50.63,184.97 32.85,184.97 32.09,185.73 32.09,190.22 ESP1.36
1S2: length 162.4
  Top Layer w0.254: U51.14 100.22,164.67 101.14,163.75 105.2,163.75 v1(106.73,165.27) ; U119.14 165.4,165.16 v1(165.4,164.51) ; U118.14 133.4,166.29 134.41,167.31 138.92,167.31 139.94,166.29 v1(140.26,166.29)
  Inner3 w0.254: ESP1.37 51.97,188.79 58.21,182.55 89.46,182.55 v1(106.73,165.27) 107.97,165.27 110.76,168.07 138.48,168.07 v1(140.26,166.29)
  Inner4 w0.254: v1(165.4,164.51) 163.62,166.29 v1(140.26,166.29)
1S3: length 152
  Top Layer w0.254: U119.13 167.24,165.73 v1(167.94,165.73) ; v1(102.41,165.22) 101.51,165.22 U51.13 ; U118.13 140,165.73 v1(140.51,165.22)
  Inner1 w0.254: v1(140.51,165.22) 139.8,164.51 104.42,164.51 103.71,165.22 v1(102.41,165.22)
  Inner3 w0.254: ESP1.38 51.92,186.25 58.21,179.95 87.68,179.95 v1(102.41,165.22)
  Inner5 w0.254: v1(140.51,165.22) 167.43,165.22 v1(167.94,165.73)
A0: length 52.1
  Top Layer w0.254: R49.2 65.5,144.5 v1(71.5,150.5) ; v1(97.5,152.5) 97.67,152.68 U51.9
  Inner2 w0.254: v1(97.5,152.5) 95.5,150.5 v1(71.5,150.5)
A1: length 61.5
  Top Layer w0.254: v1(103.52,146.56) 102.5,146.56 96.41,152.66 U51.8 96.41,152.41 95,151
  Inner2 w0.254: R47.2 140.43,131.07 139.58,131.07 124.09,146.56 v1(103.52,146.56)
A2: length 41.7
  Top Layer w0.254: U51.7 v1(95.14,154.18)
  Inner1 w0.254: v1(95.14,154.18) 95.14,153.93 116.98,132.08 123.58,132.08 124.6,131.07 125.43,131.07 R46.2
A3: length 31.8
  Top Layer w0.254: U51.6 93.86,152.15 v1(94.12,151.89)
  Inner3 w0.254: v1(94.12,151.89) 104.28,141.74 104.28,136.91 110.19,131 R45.2
A4: length 26.3
  Top Layer w0.254: U51.5 92.59,151.13 95.9,147.83 95.9,131.4 R48.2
A5: length 50.2
  Top Layer w0.254: U51.4 91.33,154.18 v1(91.58,153.93)
  Inner6 w0.254: v1(91.58,153.93) 78.12,140.47 78.12,137.16 65.5,124.55 R54.2
A6: length 68.9
  Top Layer w0.254: U51.3 90.06,154.44 v1(91.83,152.66)
  Inner2 w0.254: v1(91.83,152.66) 92.34,153.17 97.67,153.17 102.75,148.08 102.75,146.31 131.46,117.61 139.39,117.61 R52.2
A7: length 55.7
  Top Layer w0.254: U51.2 88.78,153.42 v1(95.14,147.07)
  Inner3 w0.254: v1(95.14,147.07) 95.14,145.55 109.36,131.32 109.36,130.56 114.44,125.48 115.71,125.48 124.6,116.59 125.41,116.59 R51.2
A8: length 60.6
  Top Layer w0.254: v1(93.61,133.7) 93.86,133.95 93.86,138.91 86.25,146.53 86.25,157.32 88.78,159.86 U51.23
  Inner3 w0.254: R50.2 110.14,116.86 109.94,116.86 96.91,129.89 96.91,131.16 94.37,133.7 v1(93.61,133.7)
A9: length 53.7
  Top Layer w0.254: R53.2 94.37,117.63 94.37,138.91 86.75,146.53 86.75,157.32 90.06,160.62 U51.22
A10: length 74.8
  Top Layer w0.254: U51.21 91.33,160.37 v1(88.53,157.57)
  Inner1 w0.254: R59.2 65.67,101.22 65.67,107.16 88.53,130.01 v1(88.53,157.57)
A11: length 87.2
  Top Layer w0.254: v1(95.14,157.57) 92.59,160.11 U51.20
  Inner1 w0.254: R57.2 140.5,107 126.89,120.62 126.89,131.16 125.87,132.17 124.09,132.17 116.22,140.05 112.66,140.05 v1(95.14,157.57)
A12: length 77.3
  Top Layer w0.254: v1(95.64,161.13) 93.86,162.91 U51.19
  Inner4 w0.254: v1(95.64,161.13) 95.64,160.62 124.34,131.92 124.34,102.16 R56.2
A13: length 70.6
  Top Layer w0.254: U51.18 95.14,163.41 v1(95.64,162.91)
  Inner6 w0.254: v1(95.64,162.91) 109.36,149.19 109.36,102.14 R55.2
A14: length 65
  Top Layer w0.254: v1(96.15,157.57) 96.41,157.83 U51.17
  Inner6 w0.254: v1(96.15,157.57) 96.15,131.92 96.66,131.41 96.66,102.16 R58.2
A15: length 73.4
  Top Layer w0.254: v1(106.82,155.03) 106.28,155.03 97.67,163.64 U51.16
  Inner6 w0.254: R64.2 154.83,132.17 129.68,132.17 v1(106.82,155.03)
B0: length 51.3
  Top Layer w0.254: v1(131.37,142.47) 130.86,142.98 U118.9
  Inner4 w0.254: R62.2 154.94,117.56 154.76,117.56 141.78,130.54 141.78,131.3 141.02,132.06 139.24,132.06 131.37,139.94 v1(131.37,142.47)
B1: length 68.7
  Top Layer w0.254: U118.8 129.59,140.95 128.06,139.43 128.06,134.35 131.62,130.79 131.62,126.73 v1(131.37,126.47)
  Inner4 w0.254: v1(131.37,126.47) 131.37,125.46 139.24,117.58 139.24,116.06 145.34,109.96 146.1,109.96 154.99,101.07 155.93,101.07 R61.2
B2: length 60.2
  Top Layer w0.254: U118.7 128.32,152.89 120.44,145.01 v1(119.17,145.01)
  Inner5 w0.254: v1(119.17,145.01) 95.3,145.01 81.33,131.05 80.55,131.05 R60.2
B3: length 75.9
  Top Layer w0.254: U118.6 v1(127.05,154.67)
  Inner5 w0.254: R63.2 81.25,101 89.96,109.71 90.22,109.71 96.57,116.06 96.57,116.82 105.2,125.46 106.47,125.46 111.55,130.54 111.55,131.81 119.94,140.19 119.94,147.56 v1(127.05,154.67)
B4: length 74
  Top Layer w0.254: U118.5 v1(125.78,154.41)
  Inner1 w0.254: v1(125.78,154.41) 125.78,153.4 170.99,108.19 170.99,101.01 R69.2
B5: length 64.6
  Top Layer w0.254: v1(127.3,152.89) 126.29,152.89 124.51,154.67 U118.4
  Inner6 w0.254: v1(127.3,152.89) 147.62,132.57 156,132.57 157.27,131.3 157.27,130.03 170.8,116.5 R67.2
B6: length 60.3
  Top Layer w0.254: U118.3 123.24,156.8 124.76,158.32 139.75,158.32 v1(140.76,157.31)
  Inner6 w0.254: v1(140.76,157.31) 144.32,157.31 170.48,131.15 170.85,131.15 R66.2
B7: length 59.1
  Top Layer w0.254: U118.2 121.97,154.92 116.89,149.84 v1(115.62,149.84)
  Bottom Layer w0.254: v1(115.62,149.84) 115.11,149.84 96.57,131.3 96.57,130.54 91.49,125.46 90.22,125.46 81.33,116.57 80.57,116.57 R65.2
B8: length 188.4
  Top Layer w0.254: U118.23 121.97,164.41 126.51,159.87 v1(140.73,159.87)
  Inner4 w0.254: v1(140.73,159.87) R68.2
B9: length 189.7
  Top Layer w0.254: v1(140.76,167.81) 140.51,168.07 124.51,168.07 123.24,166.8 U118.22
  Inner3 w0.254: R5.2 221.96,172.97 220.77,174.16 218.49,174.16 216.71,172.38 215.19,172.38 213.66,173.91 193.6,173.91 191.82,172.13 145.08,172.13 v1(140.76,167.81)
B10: length 187
  Top Layer w0.254: v1(128.06,160.6) 124.51,164.16 U118.21
  Inner1 w0.254: v1(128.06,160.6) 149.65,139.01 149.65,130.88 v1(195.37,85.16)
  Inner5 w0.254: v1(195.37,85.16) 220.52,60.01 220.52,20.18 R6.2
B11: length 184.9
  Top Layer w0.254: v1(129.33,160.6) 125.78,164.16 U118.20
  Inner6 w0.254: v1(129.33,160.6) 129.33,157.55 153.72,133.17 159.81,133.17 197.66,95.32 197.66,92.78 209.39,81.05 R7.2
B12: length 131
  Top Layer w0.254: U118.19 127.05,166.29 126.03,167.31 v1(125.02,167.31)
  Inner3 w0.254: v1(125.02,167.31) 111.05,153.33 22.63,153.33 12.97,143.68 9.04,143.68 R8.2
B13: length 120.5
  Top Layer w0.254: v1(127.05,163.9) 128.32,165.17 U118.18
  Inner3 w0.254: v1(127.05,163.9) 114.86,151.71 95.3,151.71 94.28,152.72 94.03,152.72 83.36,142.06 43.99,142.06 42.72,143.33 20.98,143.33 R9.2
BCK: length 34.5
  Top Layer w0.254: U50.13 6.38,183.62 v1(5.5,184.5)
  Inner1 w0.254: v1(5.5,184.5) 6,185 11,185 12.5,183.5 13.5,183.5 15.83,181.17 ESP1.40
C0: length 141.5
  Top Layer w0.254: 163.42,156.23 163.93,155.73 163.93,136.62 v1(164.18,136.37)
  Bottom Layer w0.254: U21.2 81.75,50.77 82.65,50.77 85.95,54.07 85.95,56.62 119.99,90.65 121.77,90.65 164.18,133.07 v1(164.18,136.37)
C1: length 133.9
  Top Layer w0.254: U119.8 162.15,148.82 v1(160.12,146.78)
  Inner3 w0.254: U1.2 99.02,50.75 113.38,65.11 113.38,95 160.12,141.74 v1(160.12,146.78)
C2: length 127.8
  Top Layer w0.254: v1(158.85,148.06) 160.88,150.09 U119.7
  Inner5 w0.254: v1(158.85,148.06) 158.85,141.45 109.83,92.43 109.83,53.65 U2.2
C3: length 147.2
  Top Layer w0.254: v1(159.5,150.5) 159.61,150.61 U119.6 ; v1(117.5,96) 108,86.5 104,86.5 75.09,57.59 arc(74.6,57.25) 74.26,56.76 70,52.5 68.47,52.5 U4.2
  Bottom Layer w0.254: v1(117.5,96) 121,99.5 121,103 159.5,141.5 v1(159.5,150.5)
C4: length 118.6
  Top Layer w0.254: v1(157.83,149.07) 158.34,149.58 U119.5
  Inner4 w0.254: v1(157.83,149.07) 157.07,148.31 157.07,100.56 126.72,70.21 U3.2
C5: length 111.8
  Top Layer w0.254: U119.4 157.07,154.91 v1(156.82,154.66)
  Inner2 w0.254: v1(156.82,154.66) 148.94,146.78 148.94,100.81 141.72,93.59 U9.2
C6: length 106.6
  Top Layer w0.254: v1(157.07,149.32) 155.8,150.59 155.8,156.23
  Inner2 w0.254: U5.2 157.07,50.4 v1(157.07,149.32)
C7: length 136.1
  Top Layer w0.254: v1(162.91,157.81) 162.66,158.06 155.8,158.06 154.53,156.79 U119.2
  Inner3 w0.254: v1(283.06,159.08) 283.11,159.08 U6.2
  Inner6 w0.254: v1(162.91,157.81) 164.44,159.33 239.11,159.33 241.65,156.79 242.92,156.79 245.21,159.08 v1(283.06,159.08)
C8: length 122.8
  Top Layer w0.254: v1(155.8,161.86) 154.53,163.13 U119.23
  Inner3 w0.254: v1(155.8,161.86) 172.22,145.44 U8.2
C9: length 135.2
  Top Layer w0.254: v1(159.61,168.31) 157.07,168.31 155.8,167.04 155.8,165.72
  Inner1 w0.254: v1(159.61,168.31) 245.17,168.31 251.52,174.66 286.37,174.66 286.51,174.52
C10: length 181.2
  Top Layer w0.254: v1(144.62,154.24) 149.71,159.32 154.28,159.32 157.07,162.12 U119.21
  Inner5 w0.254: v1(144.62,154.24) 140.85,154.24 82.43,95.82 43.53,95.82 41.75,94.04 24.74,94.04 22.71,96.08 10.55,96.08 U16.2
C11: length 237.8
  Top Layer w0.254: v1(35,56.5) 10.53,56.5 U12.2 ; v1(157.91,160.91) 158.34,161.34 U119.20
  Inner2 w0.254: v1(53.02,57.52) 60,64.5 114.5,64.5 125,75 125,91 132,98 145.5,98 148.5,101 148.5,151.5 v1(157.91,160.91)
  Bottom Layer w0.254: v1(53.02,57.52) 52,56.5 v1(35,56.5)
C12: length 183.9
  Top Layer w0.254: v1(95.6,168.06) 96.87,169.33 159.87,169.33 160.37,168.82 160.37,168.06 159.61,167.3 U119.19
  Inner1 w0.254: v1(95.6,168.06) 54.71,127.17 54.71,108.11 45.82,99.22 39.47,99.22 34.91,94.66 U13.2
C13: length 205.6
  Top Layer w0.254: U15.2 304.47,104 299,104 292,111 276.5,111 273.5,114 273.5,123.5 v1(269,128) ; v1(164.11,171.39) 161,168.28 161,165.5
  Bottom Layer w0.254: v1(269,128) 269,131 244,156 244,161 235,170 235,182.5 234.82,182.68 189.68,182.68 178.5,171.5 164.22,171.5 v1(164.11,171.39)
C14: length 193.5
  Top Layer w0.254: v1(166.47,157.8) 162.15,162.12 U119.17
  Inner4 w0.254: U14.2 247.75,10.28 247.75,28.51 223.11,53.15 223.11,54.67 223.67,55.23 223.67,57.92 v1(221.59,60.01)
  Bottom Layer w0.254: v1(166.47,157.8) 220.57,103.69 220.57,61.02 v1(221.59,60.01)
COL1: length 649.3
  Top Layer w0.254: 171.77,190.19 182.31,190.19 177.75,194.75 D41.1 ; v1(58.5,151.5) 50.09,151.5 U87.1 ; 25.73,69.04 D17.1 40.86,88.35 52.69,100.19 D33.1 D1.1 ; 25.73,69.04 36.83,80.13 U71.1 ; 25.73,69.04 D25.1 ; v1(133.28,191.33) 135.68,191.33 U111.1 136.71,192.47 D57.1 D49.1 156.99,193.99 154.22,191.22 U103.1 ; v1(50,37.5) 50,37.41 U55.1 ; U55.1 43.33,48.18 36.83,54.68 U79.1 ; U55.1 38.19,25.6 D9.1 40.95,12.75 U63.1
  Inner2 w0.254: v1(146,159) 142,163 142,165.5 126,181.5 ; 126,181.5 130.5,186 130.5,188.5 133.31,191.31 ; 126,181.5 116.17,191.33 v1(102.5,191.33) ; 126,181.5 115.5,171 93,171 73.08,151.08 71.26,151.08 55,134.83 55,102.5 v1(52.5,100) ; 133.31,191.31 133.33,191.33 ; 133.31,191.31 v1(133.28,191.33)
  Bottom Layer w0.254: v1(52.5,100) 57.5,95 57.5,45 v1(50,37.5) ; U111.1 136.89,190.12 U103.1 154.29,190.19 171.77,190.19 ; ESP1.8 v1(102.5,191.33) 102.5,183 71,151.5 v1(58.5,151.5)
COL2: length 774.2
  Top Layer w0.254: U72.1 22.88,27.62 28,22.5 v1(35,22.5) ; ESP1.9 70.05,198.95 94.75,174.25 D58.1 D50.1 D42.1 176.82,174.25 ; v1(227.5,136) 211,152.5 199,152.5 194.5,157 194.5,159 179.25,174.25 176.82,174.25 ; 176.82,174.25 176.82,174.32 v1(185.5,183) ; D10.1 62.96,12.73 U64.1 63.83,30.45 U56.1 61.65,33 D2.1 59.19,42.31 54.5,47 54.5,66.19 D26.1 D18.1 53.19,97.19 54.5,98.5 54.5,107 55.5,108 55.5,136.5 53.19,138.81 D34.1 v1(53.19,143.54)
  Inner1 w0.254: v1(55.59,190.73) 53.19,188.33 v1(53.19,143.54) ; U112.1 301.65,35.85 U104.1 301.52,53.39 U96.1 301.32,70.97 U88.1 301.14,88.68 301.01,88.81 301.01,98.99 295.5,104.5 295.5,141 304.5,150 314.5,150 315.5,151 315.5,174 299,190.5 193,190.5 v1(185.5,183)
  Bottom Layer w0.254: ESP1.9 55.59,195.95 v1(55.59,190.73) ; v1(35,22.5) 54.05,22.5 U64.1
COL3: length 683.3
  Top Layer w0.254: D3.1 82.56,33 U57.1 ; D11.1 81.06,16.5 U65.1 U57.1 ; U57.1 77.09,23 v1(70,23) ; U57.1 92.09,38 182.5,38 192.78,48.28 192.78,56.79 ; v1(241.5,134.5) 201.52,134.5 U81.1 192.84,125.82 U89.1 192.91,108.55 U97.1 192.78,90.86 U105.1 192.78,56.79 ; U113.1 195.32,56.79 192.78,56.79 ; D19.1 38.69,30.31 v1(39.5,29.5) ; D59.1 D51.1 318.19,55.5 D43.1 D35.1 D27.1 317.69,93.81 295,116.5 295,123.5 282.98,135.52
  Inner1 w0.254: U73.1 250.17,144 252.65,144 252.79,144.14 254.88,144.14 255.02,144 273.25,144 278.09,139.16 279.34,139.16 v1(283,135.5)
  Bottom Layer w0.254: v1(39.5,29.5) 44,25 53,25 55,23 v1(70,23) ; v1(241.5,134.5) 244,134.5 250.02,140.52 U73.1 ; U81.1 190.74,126.01 115.3,201.44 58.64,201.44 ESP1.10
COL4: length 563.7
  Top Layer w0.254: D20.1 273.06,146.5 U74.1 ; D36.1 211.48,108.72 U90.1 ; D52.1 209.19,69.5 U114.1 211.64,56.55 D60.1 ; D44.1 211.72,91.47 U98.1 ; D4.1 103.64,33 U58.1 U66.1 105.03,12.66 D12.1 ; v1(241,132) 227.41,132 U82.1 219.9,128.5 D28.1 204.36,133.83 v1(201.82,133.83)
  Inner2 w0.254: v1(241,132) 263.1,132 U74.1 ; v1(137.3,195.81) 162.45,170.66 164.99,170.66 v1(201.82,133.83)
  Inner6 w0.254: ESP1.11 58.69,203.94 80.91,203.94 81.42,204.45 83.2,204.45 83.71,203.94 88.53,203.94 89.04,204.45 93.36,204.45 93.87,203.94 103.52,203.94 104.03,204.45 105.81,204.45 106.31,203.94 111.14,203.94 111.65,204.45 115.97,204.45 116.47,203.94 129.17,203.94 v1(137.3,195.81)
  Bottom Layer w0.254: 222.27,56.68 U106.1 U98.1 222.27,108.55 U90.1 222.1,126.3 U82.1 ; U114.1 200.94,35.35 199.57,35.35 arc(199.18,35.29) 198.78,35.35 194.65,35.35 193.5,36.5 110,36.5 105.84,32.34 U58.1
COL5: length 546.9
  Top Layer w0.254: D21.1 273.88,129.19 v1(246,129.19) ; U59.1 126.85,12.76 U67.1 ; U59.1 122.19,26.38 D13.1 ; U59.1 124.89,33 D5.1 ; U91.1 215.59,173.83 U107.1 ; U83.1 192.83,34.23 U75.1 ; D45.1 D37.1 238.69,128.5 D29.1 241.81,129 v1(242,129.19) ; v1(238.5,51.5) 238.5,58.81 D61.1 D53.1 238.69,94.32 238.51,94.5 238.5,94.5
  Inner1 w0.254: ESP1.12 58.67,206.5 73,206.5 79,200.5 118,200.5 126.5,192 172.69,192 U91.1 ; v1(242,129.19) 240.81,129.19 237,133 234.5,133 215.82,151.68 U115.1
  Inner2 w0.254: U75.1 191.9,35.16 130.97,35.16 U59.1 ; U83.1 238.5,50.44 v1(238.5,51.5)
  Bottom Layer w0.254: U91.1 190.82,173.79 U99.1 ; v1(246,129.19) v1(242,129.19) ; U107.1 215.8,154.75 U115.1
COL6: length 558.6
  Top Layer w0.254: U100.1 U92.1 250.13,101.18 U84.1 U76.1 249.81,122.69 243,129.5 243,146.19 D62.1 ; U116.1 246.41,36.5 D30.1 ; U116.1 250.33,49.68 250.07,49.94 250.07,67.46 ; U116.1 229.43,32.57 226,36 209.69,36 D22.1 208.43,36.5 v1(207.61,35.69) ; D62.1 233,157.81 233,176.19 D54.1 232.69,177.31 230,180 211.19,180 D38.1 197.69,186.5 173.5,186.5 170.5,183.5 162,183.5 159.5,186 156.25,186 153.7,183.45 153.7,183.2 153.52,183.02 144.48,183.02 139,188.5 135.73,188.5 135.22,189.01 133.12,189.01 132.61,188.5 130,188.5 118,200.5 79,200.5 70.5,209 58.71,209 ESP1.13 ; D62.1 227.69,161.5 211.69,161.5 D46.1 ; U60.1 147.82,30.65 U68.1 143.56,16.5 D14.1 D6.1
  Inner1 w0.254: U100.1 250.07,67.4 250.07,49.94
  Inner2 w0.254: v1(207.61,35.69) 201.03,29.11 188.13,29.11 185.19,32.04 172.45,32.04 172,32.49 168.03,32.49 166.47,30.93 U60.1
COL7: length 684.7
  Top Layer w0.254: D55.1 270.01,49.18 U109.1 ; v1(272.69,120.46) 266.23,120.46 D23.1 ; D47.1 269.99,66.7 U101.1 275.72,66.63 U109.1 ; U109.1 U117.1 269.16,32.54 D63.1 ; D7.1 166.72,33 U61.1 168.82,30.9 U69.1 164.5,16.55 D15.1 ; D31.1 268.82,101.37 U85.1 275.65,100.92 U93.1 269.85,83.34 D39.1
  Inner1 w0.254: U93.1 263.84,83.34 258.5,78 250.5,78 244,84.5 173,84.5 148,59.5 148,51.72 U61.1 180.25,42.5 269.04,42.5 U109.1 ; U77.1 275.2,118.14 U85.1
  Inner3 w0.254: ESP1.14 59.77,210.48 v1(59.77,198.12)
  Inner5 w0.254: v1(272.69,120.46) 274.98,118.17 U77.1
  Inner6 w0.254: v1(59.77,198.12) 59.77,194.82 96.85,157.73 96.85,137.86 99.14,135.57 99.14,130.55 97.11,128.52 97.11,123.12 99.14,121.09 99.14,116.08 97.87,114.81 97.87,103.38 108.28,92.96 108.54,92.96 168.73,32.76 U61.1
COL8: length 496.1
  Top Layer w0.254: v1(280.5,112.5) 283.3,112.5 D24.1 291.63,119.87 v1(292.5,119) ; D8.1 185.19,32.5 D16.1 ; D8.1 v1(180.37,37.32) ; D8.1 195.69,44 v1(201,44) ; v1(291.69,106.5) D32.1 292.19,103.5 D40.1 D48.1 D56.1 D64.1
  Inner1 w0.254: v1(201,44) 202.39,45.39 207.89,45.39 v1(224.5,62)
  Inner6 w0.254: ESP1.21 39.38,200.39 59.22,200.39 103.67,155.94 104.68,155.94 111.79,148.82 111.79,120.12 126.78,105.14 126.78,100.31 170.21,56.88 170.21,47.48 v1(180.37,37.32)
  Bottom Layer w0.254: v1(224.5,62) 275,112.5 v1(280.5,112.5) ; v1(292.5,119) 293.5,118 293.5,110.5 291.69,108.69 v1(291.69,106.5)
DIN: length 30.3
  Top Layer w0.254: U50.14 8.03,182.97 v1(8,183)
  Inner1 w0.254: v1(8,183) 12,179 22,179 25.08,175.92 33.02,175.92 ESP1.42
DIN_IN: length 85.6
  Top Layer w0.254: v1(89.84,180.15) 109.16,180.15 R4.2 109.16,184.52 U11.5
  Bottom Layer w0.254: v1(89.84,180.15) 89.58,179.9 44.63,179.9 ESP1.RX
LRCK: length 25.7
  Top Layer w0.254: v1(26.5,177.5) 32.07,177.5 ESP1.41 ; U50.15 11.32,182.32 v1(11.5,182.5)
  Bottom Layer w0.254: v1(26.5,177.5) 17.5,177.5 13.5,181.5 13,181.5 12,182.5 v1(11.5,182.5)
MUXA_OUT: length 61.9
  Top Layer w0.254: v1(87.77,157.33) 87.52,157.08 U51.1
  Inner3 w0.254: v1(87.77,157.33) 46.88,157.33 ESP1.1
MUXB_OUT: length 94.7
  Top Layer w0.254: v1(110.28,166.71) 120.7,156.29 U118.1
  Inner5 w0.254: v1(110.28,166.71) 104.7,172.3 34.45,172.3 ESP1.2
MUXC_OUT: length 111
  Top Layer w0.254: v1(153.01,157.81) 153.26,157.56 U119.1
  Inner1 w0.254: ESP1.3 116.95,193.87 v1(153.01,157.81)
OUTL: length 27.7
  Top Layer w0.254: U50.6 v1(13,182.32)
  Bottom Layer w0.254: 14.5,198 12.6,199.9 CN1.J ; 14.5,198 17.05,200.55 CN1.I ; 14.5,198 11.5,195 11.5,183.82 v1(13,182.32)
OUTR: length 41.1
  Top Layer w0.254: CN1.C CN1.G 7.5,206.95 7.5,202 12,197.5 12,185 14.03,182.97 U50.7
ROW1: length 69.8
  Top Layer w0.254: D1.2 43.45,121 U54.2 40.64,118.73 U54.1
  Bottom Layer w0.254: U54.2 56,134.09 56,168.41 ESP1.4
ROW2: length 182.4
  Top Layer w0.254: v1(41.5,48) 41.5,40 36.5,35 36.5,17.19 D9.2 29.38,15.5 U62.2 25.2,15.87 U62.1 ; v1(53,136.5) 52,135.5 52,128 51.05,127.05 51.05,100.24 v1(49.65,98.85)
  Inner1 w0.254: v1(45,55.5) 45,60 48,63 48,78 51,81 51,97.5 v1(49.65,98.85)
  Bottom Layer w0.254: v1(41.5,48) 45,51.5 v1(45,55.5) ; v1(53,136.5) 55,138.5 55,169.95 ESP1.5
ROW3: length 110.7
  Bottom Layer w0.254: ESP1.6 43,160.49 43,149 30,136 30,111 16,97 16,92.6 U70.1
ROW4: length 132.5
  Bottom Layer w0.254: ESP1.7 23.54,143.58 23.54,137.74 7.54,121.73 7.54,70.02 9.49,68.07
ROW5: length 92.3
  Top Layer w0.254: ESP1.15 35.23,157.8 35.23,100.83 U86.1
ROW6: length 126
  Inner3 w0.254: U94.1 170.53,212.67 151.84,212.67 122.88,183.71 ESP1.16
ROW7: length 138.8
  Top Layer w0.254: v1(127.75,195.75) 143.12,211.12 U102.1
  Inner2 w0.254: ESP1.17 64.42,192.07 122.63,192.07 141.68,211.12 U102.1
ROW8: length 169.6
  Inner1 w0.254: 54,108.29 54,184.19 ESP1.18
  Inner2 w0.254: U110.1 80.89,211.08 ESP1.18
  vias: v1(54,108.29)
TX: length 70.3
  Top Layer w0.254: 89.11,195.96 86.28,193.13 v1(86.28,193.11)
  Inner1 w0.254: ESP1.TX 52.75,185.49 52.75,188.79 56.56,192.6 85.77,192.6 v1(86.28,193.11)
$1N26761: length 6.2
  Top Layer w0.254: U55.2 55.54,33.27 D2.2
$1N26911: length 6.2
  Top Layer w0.254: D4.2 91.44,33 U57.2
$1N26913: length 6.5
  Top Layer w0.254: D3.2 76.63,33.18 70.36,33.18
$1N27211: length 6.8
  Top Layer w0.254: D6.2 133.78,33 U59.2
$1N27213: length 6.8
  Top Layer w0.254: U58.2 112.53,33 D5.2
$1N27215: length 6.4
  Top Layer w0.254: D8.2 180.78,33.53 U61.2
$1N27217: length 6.5
  Top Layer w0.254: U60.2 160.34,33.47 D7.2
$1N32107: length 7.1
  Top Layer w0.254: D12.2 96.58,15.27 U65.2
$1N32109: length 6.1
  Top Layer w0.254: D11.2 74.58,15.27 U64.2
$1N32111: length 7.2
  Top Layer w0.254: D13.2 117.51,15.2 112.19,15.2
$1N32113: length 7.3
  Top Layer w0.254: D16.2 180.08,14.77 U69.2
$1N32117: length 7.1
  Top Layer w0.254: U67.2 138.58,15.27 D14.2
$1N32119: length 7.3
  Top Layer w0.254: D15.2 160.55,16.55 158.77,14.77 U68.2
$1N32129: length 6.6
  Top Layer w0.254: U63.2 54.59,15.29 D10.2
$1N33315: length 6.8
  Top Layer w0.254: 15.59,88.38 22.32,88.38 D17.2
$1N33317: length 6.7
  Top Layer w0.254: D18.2 49.58,84.27 U71.2
$1N33319: length 6.1
  Top Layer w0.254: U72.2 35.18,33.87 D19.2
$1N33321: length 6
  Top Layer w0.254: D20.2 262.12,146.69 U73.2
$1N33323: length 6.7
  Top Layer w0.254: D21.2 281.9,147 U74.2
$1N33325: length 6.7
  Top Layer w0.254: U75.2 205.54,36.77 D22.2
$1N33327: length 6.7
  Top Layer w0.254: U76.2 262.63,120.68 D23.2
$1N33329: length 6.7
  Top Layer w0.254: U77.2 281.7,120.83 D24.2
$1N33345: length 7.1
  Top Layer w0.254: D25.2 17.45,69 U78.2
$1N33347: length 6.7
  Top Layer w0.254: U79.2 49.58,67.27 D26.2
$1N33349: length 7
  Top Layer w0.254: U80.2 314.15,91.34 D27.2
$1N33351: length 7
  Top Layer w0.254: U81.2 206.26,128.55 D28.2
$1N33353: length 7.6
  Top Layer w0.254: U82.2 235.78,129.03 D29.2
$1N33355: length 6.8
  Top Layer w0.254: U83.2 228.91,36.5 D30.2
$1N33357: length 6.7
  Top Layer w0.254: D31.2 262.77,104.04 U84.2
$1N33359: length 6.8
  Top Layer w0.254: U85.2 281.64,104 D32.2
$1N35743: length 6.6
  Top Layer w0.254: D33.2 49.4,101.6 ; U86.2 49.23,101.77 49.5,101.5
$1N35745: length 6.7
  Top Layer w0.254: U87.2 43.45,140.5 D34.2
$1N35747: length 6.9
  Top Layer w0.254: D35.2 314.12,73.69 U88.2
$1N35749: length 6.7
  Top Layer w0.254: U89.2 205.65,111.15 D36.2
$1N35751: length 7
  Top Layer w0.254: U90.2 235.06,111.26 D37.2
$1N35753: length 7.2
  Top Layer w0.254: U91.2 204.18,176.37 D38.2
$1N35755: length 6.9
  Top Layer w0.254: U92.2 263.16,86.65 D39.2
$1N35757: length 6.9
  Top Layer w0.254: U93.2 282.12,86 D40.2
$1N35773: length 6.7
  Top Layer w0.254: D41.2 174.49,204.82 U94.2
$1N35775: length 6.3
  Top Layer w0.254: D42.2 174.49,183.65 U95.2
$1N35777: length 6.7
  Top Layer w0.254: D43.2 307.8,56 307.67,56.13
$1N35779: length 7.1
  Top Layer w0.254: 199.25,93.53 206.28,93.53 D44.2
$1N35781: length 7.1
  Top Layer w0.254: 228.62,94.02 234.32,94.02 D45.2
$1N35783: length 6.7
  Top Layer w0.254: U99.2 197.44,157 D46.2
$1N35785: length 6.8
  Top Layer w0.254: D47.2 263.31,70 U100.2
$1N35787: length 7
  Top Layer w0.254: U101.2 288.63,69.24 288.81,69.06 288.81,68.99
$1N35803: length 6.7
  Top Layer w0.254: D49.2 156.99,204.54 U102.2
$1N35805: length 6.2
  Top Layer w0.254: D50.2 156.76,177.91 U103.2
$1N35807: length 6.9
  Top Layer w0.254: U104.2 307.88,38.5 D51.2
$1N35809: length 6.7
  Top Layer w0.254: 199.13,75.97 205.78,75.97 D52.2
$1N35811: length 6.8
  Top Layer w0.254: 228.62,76.74 235.05,76.74 D53.2
$1N35813: length 7.2
  Top Layer w0.254: D54.2 229.23,176.58 U107.2
$1N35815: length 6.9
  Top Layer w0.254: U108.2 256.44,52.5 D55.2
$1N35817: length 6.8
  Top Layer w0.254: D56.2 288.59,51.72 U109.2
$1N35833: length 6.6
  Top Layer w0.254: D57.2 139.08,198.23 U110.2
$1N35835: length 6.4
  Top Layer w0.254: D58.2 139.25,177.89 139.25,183.95
$1N35837: length 6.9
  Top Layer w0.254: D59.2 314.67,20.86 U112.2
$1N35839: length 12
  Top Layer w0.254: U113.2 202.04,61.24 203.94,59.33 205.48,59.33 D60.2
$1N35841: length 6.9
  Top Layer w0.254: D61.2 235.22,59.09 U114.2
$1N35843: length 6.7
  Top Layer w0.254: U115.2 228.54,157.27 D62.2
$1N35845: length 6.7
  Top Layer w0.254: D63.2 256.8,35 U116.2
$1N35847: length 6.8
  Top Layer w0.254: U117.2 282.15,35 D64.2
$1N41810: length 5.2
  Top Layer w0.254: C14.1 20.93,179.72 U50.2
$1N41812: length 7.8
  Top Layer w0.254: U50.5 19.18,181.68 20,182.5 22.2,182.5 C15.1
$1N41842: length 3
  Top Layer w0.254: U50.18 7.97,180.38 C16.2
$1N41846: length 6.9
  Top Layer w0.254: R1.2 v1(91.4,199.76)
  Inner2 w0.254: U49.5 91.4,201.45 v1(91.4,199.76)
$1N41847: length 6
  Top Layer w0.254: v1(82.95,199.81) 84.47,198.28 R2.2
  Inner2 w0.254: U49.4 82.95,202.72 v1(82.95,199.81)
$1N41854: length 8.6
  Top Layer w0.254: R3.2 110.91,198.49 v1(109.64,199.76)
  Inner5 w0.254: v1(109.64,199.76) 108.51,199.76 U10.4
$1N41855: length 2.9
  Top Layer w0.254: R3.1 112.18,194.34 U11.1
$1N41856: length 12.5
  Top Layer w0.254: v1(112.36,199.81) 113.13,199.05 113.13,198.03 112.87,197.78 111.6,197.78 109.47,195.65 U11.2
  Inner3 w0.254: U10.5 v1(112.36,199.81)
$1N41902: length 5.2
  Top Layer w0.254: U50.4 20.82,181.03 C14.2

## Copper pours and planes (outline as drawn; the poured copper is in the pictures)
GND on Top Layer: -14,236 345.5,236 345.5,-25 -14,-25
GND on Bottom Layer: -19,237.5 358,237.5 358,-21 -19,-21
GND on Inner1: -15,236 356,236 356,-28 -15,-28
GND on Inner2: -27,241 346.5,241 346.5,-30 -27,-30
GND on Inner3: -33.5,236 329.5,236 329.5,-34.5 -33.5,-34.5
GND on Inner4: -26.5,233.5 339.5,233.5 339.5,-35 -26.5,-35
GND on Inner5: -18,229 337.5,229 337.5,-31.5 -18,-31.5
GND on Inner6: -5.5,224.5 328.5,224.5 328.5,-15 -5.5,-15
